# Altium schematic sheet MCU.SchDoc
size A; SheetNumber: 6; SheetTotal: 8
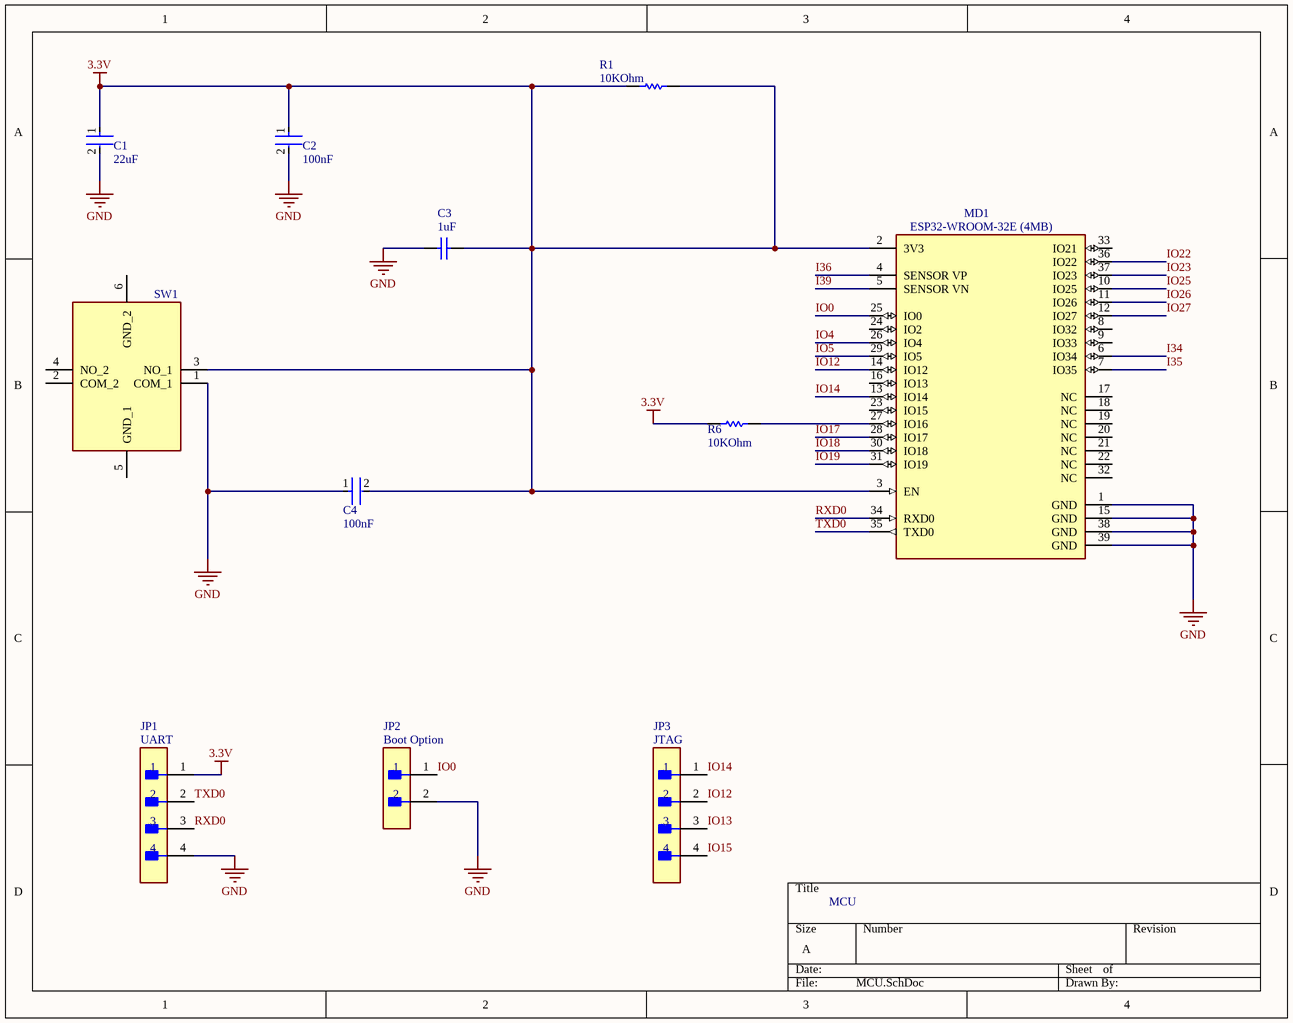
[diagram p0: MCU.SchDoc]

## Parts
C1  Capacitance: 22uF  [FP-GRM21B-0_15-MFG]  (hidden comment: GRM21BR60J226ME39L)
C2  Capacitance: 100nF  [FP-GRM033-0_03-IPC_C]  (hidden comment: GRM033R61A104KE15D)
C3  Capacitance: 1uF  [CAPC2013X145X50LL20T25]  (hidden comment: C0805C105K4PACTU)
C4  Capacitance: 100nF  [FP-GRM033-0_03-IPC_C]  (hidden comment: GRM033R61A104KE15D)
JP1  Purpose: UART  [FP-B4B-XH-A_LF_SN-MFG]  (hidden comment: B4B-XH-A(LF)(SN))
JP2  Purpose: Boot Option  [FP-B2B-XH-A_LF_SN-MFG]  (hidden comment: B2B-XH-A(LF)(SN))
JP3  Purpose: JTAG  [FP-B4B-XH-A_LF_SN-MFG]  (hidden comment: B4B-XH-A(LF)(SN))
MD1  ESP32-WROOM-32E (4MB)  [FP-ESP32-WROOM-32E_4MB-MFG]
R1  Resistance: 10KOhm  [RESC1005X40X25LL05T05]  (hidden comment: ERJ2RKF1002X)
R6  Resistance: 10KOhm  [RESC1005X40X25LL05T05]  (hidden comment: ERJ2RKF1002X)
SW1  PTS526SMG20SMTR21_LFS  [PTS526SMG20SMTR21LFS]  (value not drawn)

## Nets
3.3V: C1.1 C2.1 C3.2 C4.2 JP1.1 MD1.2(3V3) MD1.3(EN) R1.1 R1.2 R6.1 SW1.3(NO_1)
GND: C1.2 C2.2 C3.1 C4.1 JP1.4 JP2.2 MD1.1(GND) MD1.15(GND) MD1.38(GND) MD1.39(GND) SW1.1(COM_1)
I34: MD1.6(IO34)
I35: MD1.7(IO35)
I36: MD1.4(SENSOR_VP)
I39: MD1.5(SENSOR_VN)
IO0: JP2.1 MD1.25(IO0)
IO4: MD1.26(IO4)
IO5: MD1.29(IO5)
IO12: JP3.2 MD1.14(IO12)
IO13: JP3.3
IO14: JP3.1 MD1.13(IO14)
IO15: JP3.4
IO17: MD1.28(IO17)
IO18: MD1.30(IO18)
IO19: MD1.31(IO19)
IO22: MD1.36(IO22)
IO23: MD1.37(IO23)
IO25: MD1.10(IO25)
IO26: MD1.11(IO26)
IO27: MD1.12(IO27)
RXD0: JP1.3 MD1.34(RXD0)
TXD0: JP1.2 MD1.35(TXD0)
NetMD1_27: MD1.27(IO16) R6.2

Not connected (* = marked no-connect by the designer): MD1 8(IO32) 9(IO33) 16(IO13) 17(NC) 18(NC) 19(NC) 20(NC) 21(NC) 22(NC) 23(IO15) 24(IO2) 32(NC) 33(IO21); SW1 2(COM_2) 4(NO_2) 5(GND_1) 6(GND_2)

## Notes on the sheet
- MCU

## Library data of the parts
C1 = CMP-2007-03385-2: Chip Multilayer Ceramic Capacitors for General Purpose, 0805, 22uF, X5R, 15%, 20%, 6.3V; Material: Ceramic; Max Operating Temperature: 85°C; Voltage: 6.3V; Min Operating Temperature: -55°C; Case/Package: 0805; Thickness: 0.053inch; Dielectric: X5R; Packaging: Tape and Reel; Depth: 1.25mm; Termination: SMD/SMT; Voltage Rating (DC): 6.3V; Radiation Hardening: No; Tolerance: 20%; Mount: Surface Mount; Lead Free: Lead Free; Package Quantity: 1; REACH SVHC: No SVHC; Voltage Rating: 6.3V; Length: 2mm; Case Code (Imperial): 0805; Case Code (Metric): 2012; Width: 0.049inch; Height: 1.25mm
C2 C4 = CMP-2010-01264-2: Chip Multilayer Ceramic Capacitors for General Purpose, 0201, 0.10uF, X5R, 15%, 10%, 10V; Mount: Surface Mount; Dielectric: X5R; Width: 0.012inch; Tolerance: 10%; Radiation Hardening: No; Voltage Rating: 10V; REACH SVHC: No SVHC; Height: 0.3mm; Max Operating Temperature: 85°C; Voltage Rating (DC): 10V; Thickness: 0.013inch; Termination: SMD/SMT; Lead Free: Lead Free; Package Quantity: 1; Case/Package: 0201; Min Operating Temperature: -55°C; Weight: 6E-06oz; Length: 0.6mm; Case Code (Imperial): 0201; Depth: 0.3mm; Voltage: 10V; Packaging: Tape and Reel; Case Code (Metric): 0603
C3 = CMP-1036-04746-2: Manufacturer: Kemet; Part Number: C0805C105K4PACTU
JP1 JP3 = CMP-17439-000250-1: CONN HEADER VERT 4POS 2.5MM; Number of Contacts: 4; Contact Resistance: 20mR; Voltage Rating: 250V; Max Current Rating: 3A; Gender: Male; Wire/Cable Gauge: 22AWG; Mated Stacking Heights: 9.8mm; Insulation Resistance: 1GR; Orientation: Straight; Contact Type: Male Pin; Contact Finish - Mating: TIN; Series: XH; Max Voltage Rating (AC): 250V; Lead Pitch: 2.5mm; Contact Shape: Square; Insulation Color: Natural; Termination: Solder; Lead Free: Lead Free; Voltage Rating (AC): 250V; Number of Rows: 1; Flammability Rating: UL94 V-0; Number of Positions: 4; Max Operating Temperature: 85°C; Package Quantity: 500; Mount: Through Hole; REACH SVHC: No SVHC; Connector Type: Header; Insulation Material: Nylon; Fastening Type: Detent; Min Operating Temperature: -25°C; Housing Color: White; Packaging: Bulk; Contact Plating: Tin; Contact Material: Brass; Max Voltage Rating (DC): 250V; Housing Material: Polyamide; Color: Natural; Material: Polyamide; Pitch: 2.5mm; Depth: 5.75mm; Current Rating: 3A; Length: 12.4mm
JP2 = CMP-2000-05888-3: CONN HEADER VERT 2POS 2.5MM; Current Rating: 3A; Voltage Rating: 250V; Number of Contacts: 2; Contact Resistance: 20mR; Wire/Cable Gauge: 22AWG; Insulation Resistance: 1GR; Connector Type: Male Pin; Packaging: Bulk; Contact Material: Brass; Lead Free: Lead Free; Orientation: Straight; Contact Plating: Tin; Max Current Rating: 3A; Termination: Solder; Fastening Type: Detent; Depth: 5.75mm; Housing Material: Polyamide; REACH SVHC: No SVHC; Series: XH; Voltage Rating (AC): 250V; Number of Positions: 2; Color: Natural; Contact Type: Male Pin; Max Voltage Rating (DC): 250V; Pitch: 2.5mm; Lead Pitch: 2.5mm; Mount: Through Hole; Max Operating Temperature: 85°C; Length: 7.4mm; Max Voltage Rating (AC): 250V; Min Operating Temperature: -25°C; Number of Rows: 1; Housing Color: White
MD1 = CMP-194065-000026-1: RX TXRX MOD WIFI TRACE ANT SMD
R1 R6 = CMP-2000-07588-1: Chip Resistor, 10 KOhm, +/- 1%, 0.1 W, -55 to 155 degC, 0402 (1005 Metric), RoHS, Tape and Reel; Manufacturer: Panasonic; Power Rating: 100mW; Voltage Rating: 50V; Case\/Package: 0402; Temperature Coefficient: 100ppm\/degreesC; RoHSCompliant: True; Lead Free: LeadFree; Package Quantity: 1; Contact Plating: Tin; Length: 1mm; Radiation Hardening: No; REACH SVHC: NoSVHC; Max Operating Temperature: 155degC; Depth: 0.5mm; Case Code (Imperial): 0402; Military Standard: Not; Package Description: 2-Pin Surface Mount Device, Body 1 x 0.5 mm; Termination: SMD/SMT; Case Code (Metric): 1005; Height: 0.35mm; Packaging: TapeandReel; Voltage Rating (DC): 50V; Package Reference: 402; Number of Pins: 2; Tolerance: 1%; Mounting Technology: SurfaceMount; Width: 0.02inch; Mount: SurfaceMount; Datasheet URL: https://industrial.panasonic.com/cdbs/www-data/pdf/RDA0000/AOA0000C304.pdf; Composition: ThickFilm; Datasheet Version: 02/2017; Manufacturer URL: http://www.panasonic.com/; Max Power Dissipation: 100mW; Number of Terminations: 2; Min Operating Temperature: -55degC
SW1 = PTS526SMG20SMTR21_LFS: Switch; Manufacturer_Name: C & K COMPONENTS; Manufacturer_Part_Number: PTS526SMG20SMTR21 LFS; Datasheet Link: https://www.ckswitches.com/media/2780/pts526.pdf; Height: 2.15mm; Mouser Part Number: 611-PTS526SMG20S21LF; Mouser Price/Stock: https://www.mouser.co.uk/ProductDetail/CK/PTS526SMG20SMTR21-LFS?qs=MyNHzdoqoQLOqPcVU%2F1RhA%3D%3D; Arrow Part Number: PTS526SMG20SMTR21 LFS; Arrow Price/Stock: https://www.arrow.com/en/products/pts526smg20smtr21-lfs/ck?region=nac